# EAGLE design B4L_power_PCB (EAGLE 9.5.2)
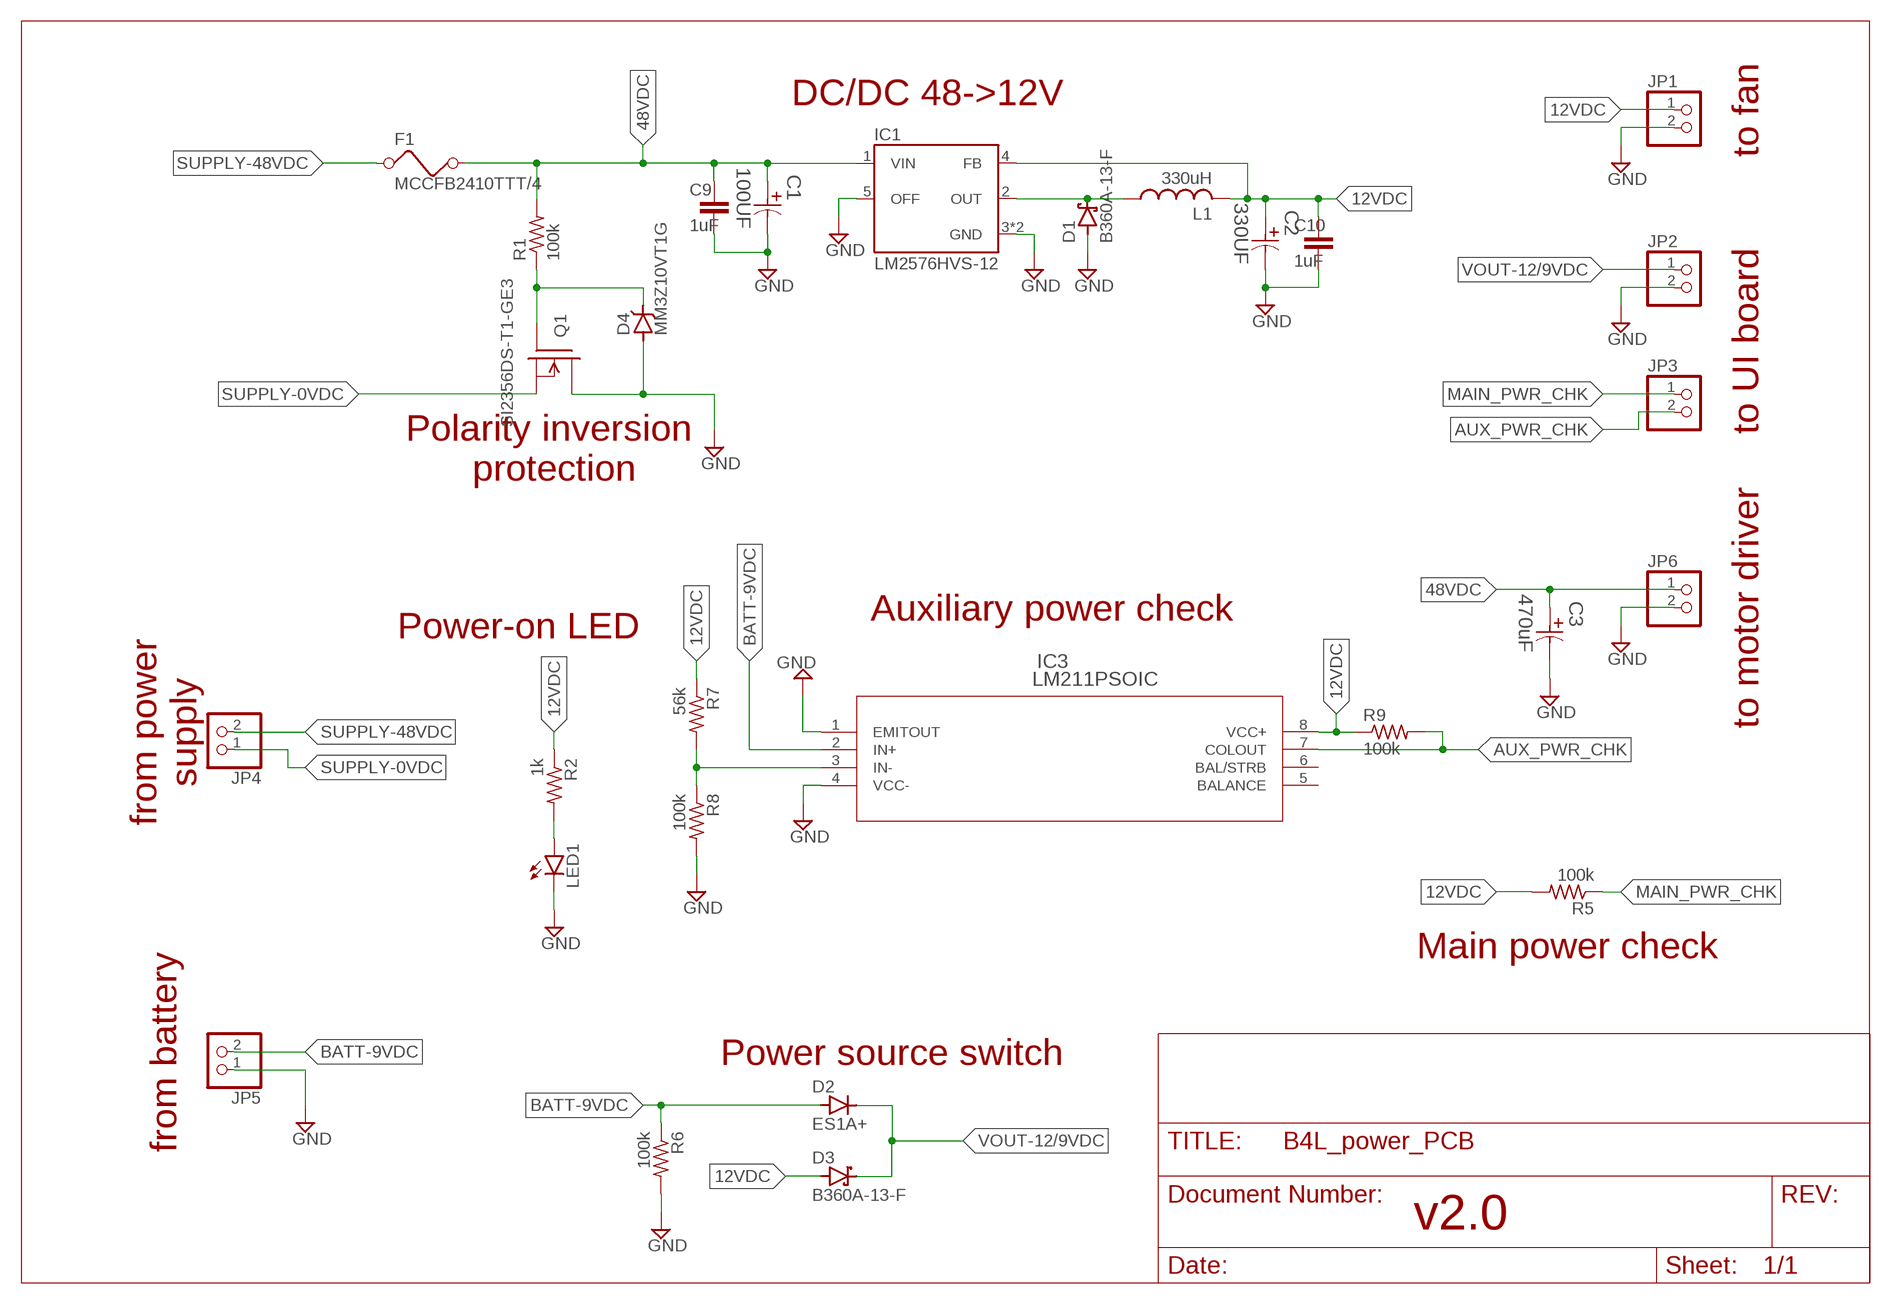
[diagram p0: schematic, sheet 1]

## Parts
C1  100UF  EEV-EB2D101M-CASE-K21  [CAPAE1900X2200N]
C2  330UF  EEE-FT1V331AP-CASE-F  [CAPAE830X1050N]
C3  470uF  EEVFK1K471M-CASE-K16  [CAPAE1900X1700N]
C9  1uF  C-EUC1206  [C1206]
C10  1uF  C-EUC0603  [C0603]
D1  B360A-13-F  [DO214AC]
D2  ES1A+  ESIA+  [DO214AC]
D3  B360A-13-F  [DO214AC]
D4  MM3Z10VT1G  [SOD323]
F1  MCCFB2410TTT/4  [MCCFB2410TTT/4]
IC1  LM2576HVS-12  LM2576HVS  [TO263-5]
IC3  LM211PSOIC  [SO08]
JP1  PINHD-1X2  [1X02]
JP2  PINHD-1X2  [1X02]
JP3  PINHD-1X2  [1X02]
JP4  PINHD-1X2  [1X02]
JP5  PINHD-1X2  [1X02]
JP6  PINHD-1X2  [1X02]
L1  330uH  SRR1280A-331K  [SRR1280A-331K]
LED1  LED3MM  [LED3MM]
Q1  SI2356DS-T1-GE3  [SOT23]
R1  100k  R-US_R0603  [R0603]
R2  1k  R-US_R0603  [R0603]
R5  100k  R-US_R0603  [R0603]
R6  100k  R-US_R0603  [R0603]
R7  56k  R-US_R0603  [R0603]
R8  100k  R-US_R0603  [R0603]
R9  100k  R-US_R0603  [R0603]

## Nets
12VDC: C2.1 C10.1 D3.A IC1.4(FB) IC3.8(VCC+) JP1.1 L1.P$2 R2.1 R5.2 R7.1 R9.1
48VDC: C1.1 C3.1 C9.1 F1.P$2 IC1.1(VIN) JP6.1 R1.2
AUX_PWR_CHK: IC3.7(COLOUT) JP3.2 R9.2
BATT-9VDC: D2.A IC3.2(IN+) JP5.2 R6.1
GND: C1.2 C2.2 C3.2 C9.2 C10.2 D1.A D4.2(A) IC1.3(GND) IC1.5(OFF) IC1.6(GND) IC3.1(EMITOUT) IC3.4(VCC-) JP1.2 JP2.2 JP5.1 JP6.2 LED1.K(C) Q1.3(D) R6.2 R8.2
MAIN_PWR_CHK: JP3.1 R5.1
N$1: D1.C IC1.2(OUT) L1.P$1
N$2: D4.1(C) Q1.1(G) R1.1
N$3: LED1.A R2.2
N$4: IC3.3(IN-) R7.2 R8.1
SUPPLY-0VDC: JP4.1 Q1.2(S)
SUPPLY-48VDC: F1.P$1 JP4.2
VOUT-12/9VDC: D2.C D3.C JP2.1
Unconnected: IC3.5(BALANCE) IC3.6(BAL/STRB)

## Notes on the sheet
- DC/DC 48->12V
- to fan
- to UI board
- Polarity inversion 
  protection
- Auxiliary power check | to motor driver
- Power-on LED
- from power
  supply
- Main power check
- from battery | Power source switch
- v2.0

## Library data of the parts
C1 = custom:EEV-: Aluminum Electrolytic Capacitors,Surface Mount Type; MPN: EEV-EB2D101M; OC_FARNELL: 2282073; OC_NEWARK: 53W3881; PACKAGE: CASE-K21; SUPPLIER: PANASONIC; TOLERANCE: ±20 %; VOLTAGERATING: 200V
C2 = custom:EEE-: Aluminum Electrolytic Capacitors,Surface Mount Type; MPN: EEE-FT1V331AP; OC_FARNELL: 1868419; OC_NEWARK: 31T8189; PACKAGE: CASE-F; SUPPLIER: PANASONIC; TOLERANCE: ±20 %; VOLTAGERATING: 35V
C3 = custom:EEVFK1K471M: Aluminum Electrolytic Capacitors,Surface Mount Type
C9 C10 = rcl:C-EU: CAPACITOR, European symbol; SPICEPREFIX: C
D1 D3 = custom:B360A-13-F
D2 = custom:ESIA+
D4 = custom:MM3Z10VT1G
F1 = custom:MCCFB2410TTT/4
IC1 = custom:LM2576HV: National Semiconductor <http://www.national.com> 3.0A "Simple Switcher"(c) 52kHz, Vout 1.23-37V (HV: 57V), Vin 40V (HV: 60V), 50µA standby current
IC3 = custom:LM211P
JP1-JP6 = pinhead:PINHD-1X2: PIN HEADER
L1 = custom:SRR1280A-331K
LED1 = led:LED: LED OSRAM: - CHIPLED LG R971, LG N971, LY N971, LG Q971, LY Q971, LO R971, LY R971 LH N974, LH R974 LS Q976, LO Q976, LY Q976 LO Q996 - Hyper CHIPLED LW Q18S LB Q993, LB Q99A, LB R99A - SideLED LS A670, LO A670, LY A670, LG A670, LP A670 LB A673, LV A673, LT A673, LW A673 LH A674 LY A675 LS A676, LA A676, LO A676, LY A676, LW A676 LS A679, LY A679, LG A679 - Hyper Micro SIDELED® LS Y876, LA Y876, LO Y876, LY Y876 LT Y87S - SmartLED LW L88C, LW L88S LB L89C, LB L89S, LG L890 LS L89K, LO L89K, LY L89K LS L896, LA L896, LO L896, LY L896 - TOPLED LS T670, LO T670, LY T670, LG T670, LP T670 LSG T670, LSP T670, LSY T670, LOP T670, LYG T670 LG T671, LOG T671, LSG T671 LB T673, LV T673, LT T673, LW T673 LH T674 LS T676, LA T676, LO T676, LY T676, LB T676, LH T676, LSB T676, LW T676 LB T67C, LV T67C, LT T67C, LS T67K, LO T67K, LY T67K, LW E67C LS E67B, LA E67B, LO E67B, LY E67B, LB E67C, LV E67C, LT E67C LW T67C LS T679, LY T679, LG T679 LS T770, LO T770, LY T770, LG T770, LP T770 LB T773, LV T773, LT T773, LW T773 LH T774 LS E675, LA E675, LY E675, LS T675 LS T776, LA T776, LO T776, LY T776, LB T776 LHGB T686 LT T68C, LB T68C - Hyper Mini TOPLED® LB M676 - Mini TOPLED Santana® LG M470 LS M47K, LO M47K, LY M47K Source: http://www.osram.convergy.de LUXEON: - LUMILED® LXK2-PW12-R00, LXK2-PW12-S00, LXK2-PW14-U00, LXK2-PW14-V00 LXK2-PM12-R00, LXK2-PM12-S00, LXK2-PM14-U00 LXK2-PE12-Q00, LXK2-PE12-R00, LXK2-PE12-S00, LXK2-PE14-T00, LXK2-PE14-U00 LXK2-PB12-K00, LXK2-PB12-L00, LXK2-PB12-M00, LXK2-PB14-N00, LXK2-PB14-P00, LXK2-PB14-Q00 LXK2-PR12-L00, LXK2-PR12-M00, LXK2-PR14-Q00, LXK2-PR14-R00 LXK2-PD12-Q00, LXK2-PD12-R00, LXK2-PD12-S00 LXK2-PH12-R00, LXK2-PH12-S00 LXK2-PL12-P00, LXK2-PL12-Q00, LXK2-PL12-R00 Source: www.luxeon.com KINGBRIGHT: KA-3528ASYC Source: www.kingbright.com
Q1 = custom:SI2356DS-T1-GE3
R1 R2 R5-R9 = rcl:R-US_: RESISTOR, American symbol; SPICEPREFIX: R

## Board
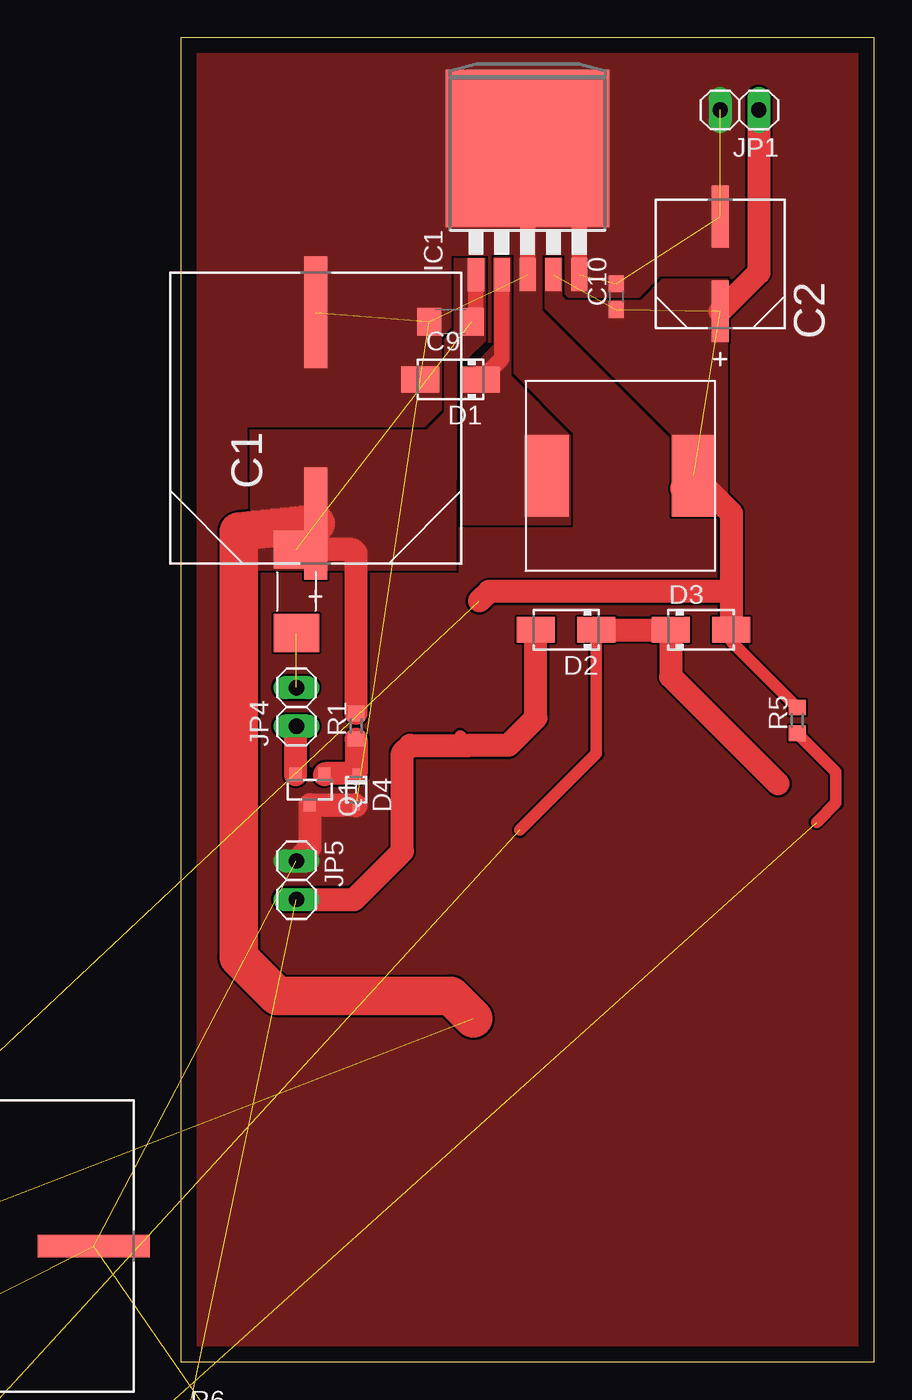
[diagram p1: board, top side]
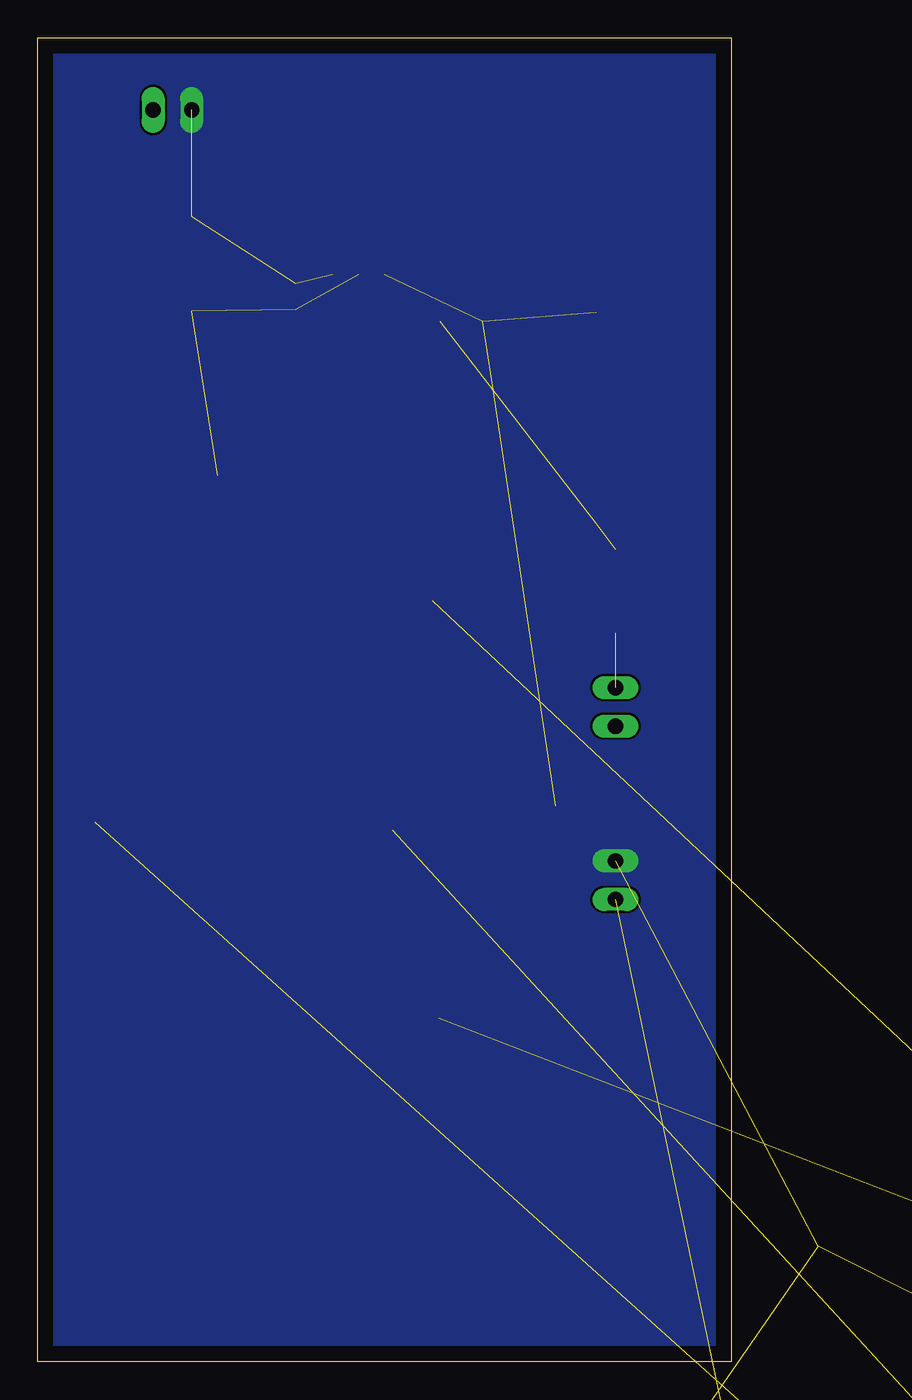
[diagram p2: board, bottom side, seen from below]

Size 45.7 x 87.3 mm. Coordinates in mm from the lower left corner, seen from the top.
Outline: 0,0 45.7,0 45.7,87.3 0,87.3 0,0
Copper layers (1*16): Top 0.035mm / dielectric 1.5mm / Bottom 0.035mm
Design rules "default": minimum track width 6mil, minimum drill 0.35mm, track to track 6mil, track to pad 6mil, pad to pad 6mil, via to via 6mil, smd to smd 6mil, copper to edge 40mil, drill to drill 6mil, minimum pad ring 10mil, minimum via ring 8mil, stop-mask expansion 4mil, vias tented up to drill 0mil, thermal gap 10mil

### Footprints (pad centres in the part's own frame; a part is rotated, then mirrored left to right if it is on the bottom)
CAPAE1900X2200N = smd 7.366 x 1.499: 1 -6.96,0; 2 6.96,0
CAPAE830X1050N = smd 4.064 x 1.092: 1 -3.124,0; 2 3.124,0
CAPAE1900X1700N = smd 7.366 x 1.499: 1 -6.96,0; 2 6.96,0
C1206 = smd 1.6 x 1.8: 1 -1.4,0; 2 1.4,0
C0603 = smd 1.1 x 1: 1 -0.85,0; 2 0.85,0
DO214AC = smd 2.5 x 1.7: A 2,0; C -2,0
SOD323 = smd 0.6 x 0.45: 1 -1.06,0; 2 1.06,0
MCCFB2410TTT/4 = smd 2.5 x 3: P$1 2.75,0; P$2 -2.75,0
TO263-5 = smd 1.067 x 2.159: 1 -3.404,-5.791; 2 -1.702,-5.791; 3 0,-5.791; 4 1.702,-5.791; 5 3.404,-5.791 | smd 10.8 x 10.41: 6 0,2.54
SO08 = smd 0.6 x 2.2: 1 -1.905,-2.6; 2 -0.635,-2.6; 3 0.635,-2.6; 4 1.905,-2.6; 5 1.905,2.6; 6 0.635,2.6; 7 -0.635,2.6; 8 -1.905,2.6
1X02 = drill 1.016 long: 1 -1.27,0; 2 1.27,0
SRR1280A-331K = smd 5.4 x 2.9: P$1 0,0; P$2 0,9.7
LED3MM = drill 0.813 octagon: A -1.27,0; K 1.27,0
SOT23 = smd 0.8 x 0.9: 1 -0.95,-1; 2 0.95,-1; 3 0,1
R0603 = smd 1 x 1.1: 1 -0.85,0; 2 0.85,0

### Placement (x,y rotation side)
C1  8.89,62.23 90 top
C2  35.56,72.39 90 top
C3  -12.7,7.62 0 top  (outside the outline)
C9  17.78,68.58 180 top
C10  28.7,70.23 90 top
D1  17.78,64.77 180 top
D2  25.4,48.26 180 top
D3  34.29,48.26 0 top
D4  11.56,37.72 270 top
F1  7.62,50.8 270 top
IC1  22.86,77.47 0 top
IC3  -30.48,-1.27 0 top  (outside the outline)
JP1  36.83,82.55 180 top
JP2  -31.75,-25.4 0 top  (outside the outline)
JP3  -31.75,-31.75 0 top  (outside the outline)
JP4  7.62,43.18 90 top
JP5  7.62,31.75 270 top
JP6  -31.75,-38.1 0 top  (outside the outline)
L1  24.13,58.42 270 top
LED1  -31.75,-43.18 0 top  (outside the outline)
Q1  8.51,37.72 180 top
R1  11.56,41.91 90 top
R2  -33.02,-48.26 0 top  (outside the outline)
R5  40.64,42.29 90 top
R6  1.27,-3.81 0 top  (outside the outline)
R7  -33.02,-13.97 0 top  (outside the outline)
R8  -33.02,-8.89 0 top  (outside the outline)
R9  -33.02,-19.05 0 top  (outside the outline)

### Tracks (layer width: path | path; a pad name or v marks a point on that pad's centre or on a via)
12VDC  (7 unrouted)
  Top 0.762: D3.A 36.29,47.49 R5.2
  Top 1.524: JP1.1 38.1,71.81 C2.1 | 33.02,57.61 L1.P$2 36.29,55.96 36.29,50.8 | 36.29,50.8 D3.A | 36.29,50.8 20.32,50.8 19.68,50.16
  pour Top (no thermals): 24,72.77 24,69.47 32.38,61.09 32.38,55.75 35.94,55.75 36.07,55.88 36.07,71.37 31.75,71.37 30.35,69.98 25.4,69.98 25.15,70.23 25.15,72.77
48VDC  (4 unrouted)
  Top 1.016: IC1.1 19.46,69.41 C9.1
  Top 1.524: R1.2 11.56,53.34 11.35,53.55 F1.P$2
  Top 2.54: C1.1 3.81,54.74 3.81,26.67 6.35,24.13 17.78,24.13 19.28,22.63
  pour Top (no thermals): 4.57,61.47 16.26,61.47 17.4,62.61 17.4,67.44 18.03,68.07 18.03,72.77 20.07,72.77 20.07,67.31 18.92,66.17 18.16,66.17 18.16,58.17 4.57,58.17
  pour Top (no thermals): 4.57,58.17 4.57,52.2 18.16,52.2 18.16,58.17
AUX_PWR_CHK  (2 unrouted)
BATT-9VDC  (2 unrouted)
  Top 0.762: 18.41,41.27 19.05,40.64
  Top 1.524: JP5.2 11.43,30.48 14.61,33.66 14.61,40.13 15.11,40.64 19.05,40.64 21.59,40.64 23.4,42.45 D2.A
GND  (15 unrouted)
  Top 1.016: IC1.3 22.86,78.74 | 22.86,78.74 IC1.6 | IC1.5 26.26,75.34 22.86,78.74
  Top 1.524: D4.2 11.5,36.72 Q1.3 8.51,33.91 JP5.1
  pour Top (no thermals): 25.78,74.8 25.78,70.48 29.97,70.48 32.77,73.28 36.45,73.28 36.45,85.85 4.57,85.85 4.57,62.99 17.02,62.99 17.02,67.56 17.53,68.07 17.53,74.8
  pour Bottom (rank 6, no thermals): 0,0 45.72,0 45.72,87.25 0,87.25
  pour Top (rank 6, no thermals): 0,0 45.72,0 45.72,87.25 0,87.25
MAIN_PWR_CHK  (1 unrouted)
  Top 0.762: R5.1 43.18,38.9 43.18,36.83 41.91,35.56
N$1
  Top 1.016: IC1.2 21.16,66.15 D1.C
  pour Top (no thermals): 20.7,72.77 20.7,67.06 19.18,65.53 18.54,65.53 18.54,55.24 25.65,55.24 25.65,61.09 21.72,65.02 21.72,72.77
N$2
  Top 1.524: R1.1 D4.1 9.52,38.78 Q1.1
N$3  (1 unrouted)
N$4  (2 unrouted)
SUPPLY-0VDC
  Top 1.524: Q1.2 7.56,41.85 JP4.1
SUPPLY-48VDC  (1 unrouted)
VOUT-12/9VDC  (1 unrouted)
  Top 0.762: D2.C 27.4,40.1 22.35,35.05
  Top 1.524: D2.C D3.C 32.29,45.18 39.37,38.1